# EAGLE schematic sr44-aka-companion (EAGLE 9.6.2)

## Sheet 1 of 3
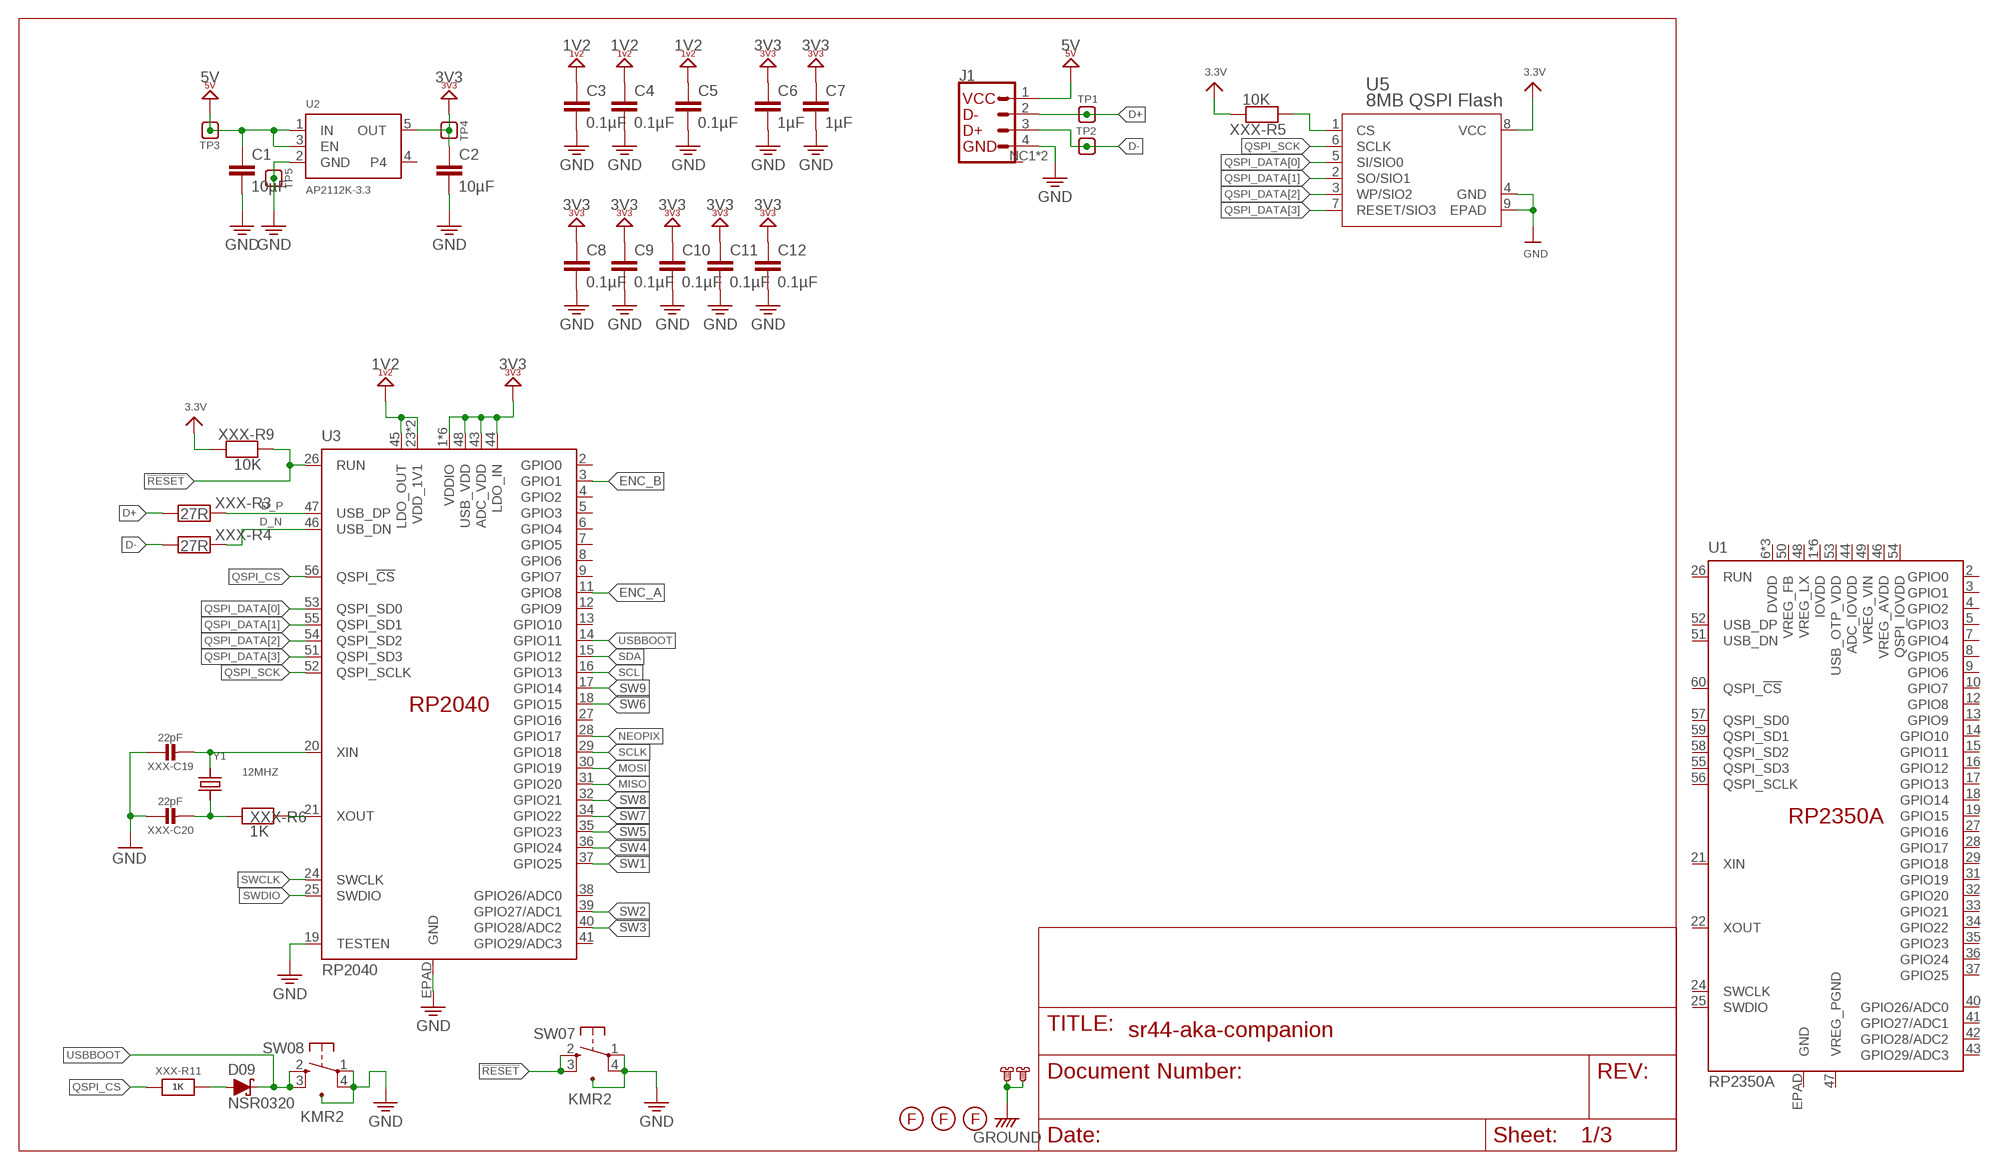
[diagram p0: schematic, sheet 1]

### Parts
C1  10µF  C-EUC0603  [C0603]
C2  10µF  C-EUC0603  [C0603]
C3  0.1µF  C-EUC0603  [C0603]
C4  0.1µF  C-EUC0603  [C0603]
C5  0.1µF  C-EUC0603  [C0603]
C6  1µF  C-EUC0603  [C0603]
C7  1µF  C-EUC0603  [C0603]
C8  0.1µF  C-EUC0603  [C0603]
C9  0.1µF  C-EUC0603  [C0603]
C10  0.1µF  C-EUC0603  [C0603]
C11  0.1µF  C-EUC0603  [C0603]
C12  0.1µF  C-EUC0603  [C0603]
D09  NSR0320  1N5819WS  [SOD-123]
J1  UBD-S1_C4  [MOLEX_781710004]
SW07  KMR2  KMR221GLFSSW4_KMR221GLFS_CNK  [SW4_KMR221GLFS_CNK]
SW08  KMR2  KMR221GLFSSW4_KMR221GLFS_CNK  [SW4_KMR221GLFS_CNK]
TP1  TEST-POINT.3RN  [PAD.03X.03-RN]
TP2  TEST-POINT.3RN  [PAD.03X.03-RN]
TP3  TEST-POINT.3RN  [PAD.03X.03-RN]
TP4  TEST-POINT.3RN  [PAD.03X.03-RN]
TP5  TEST-POINT.3RN  [PAD.03X.03-RN]
U1  RP2350A  [QFN-60]
U2  AP2112K-3.3  VREG_SOT23-5  [SOT23-5]
U3  RP2040  [QFN-56]
U5  8MB QSPI Flash  MX25R1635FZUIL0USON-8L-2X3X0P6_MAC-M  [USON-8L-2X3X0P6_MAC-M]
U$44  MOUNTING-HOLE-2.2  [MOUNTING-HOLE-2.2]
U$51  MOUNTING-HOLE-2.2  [MOUNTING-HOLE-2.2]
U$54  FIDUCIAL  [FIDUCIAL]
U$55  FIDUCIAL  [FIDUCIAL]
U$56  FIDUCIAL  [FIDUCIAL]
XXX-C19  22pF  CAP_CERAMIC_0402NO  [_0402NO]
XXX-C20  22pF  CAP_CERAMIC_0402NO  [_0402NO]
XXX-R3  27R  RESISTOR_0402NO  [_0402NO]
XXX-R4  27R  RESISTOR_0402NO  [_0402NO]
XXX-R5  10K  RESISTOR_0402NO  [_0402NO]
XXX-R6  1K  RESISTOR_0402NO  [_0402NO]
XXX-R9  10K  RESISTOR_0402NO  [_0402NO]
XXX-R11  1K  RESISTOR_0402NO  [_0402NO]
Y1  12MHZ  CRYSTAL2.5X2.0  [CRYSTAL_2.5X2]

### Nets
3.3V [power]: U5.8(VCC) XXX-R5.2 XXX-R9.1
!RESET: SW07.2 SW07.3 U3.26(RUN) XXX-R9.2
D+: J1.2(DN) TP1.1 XXX-R3.2
D-: J1.3(DP) TP2.1 XXX-R4.2
D_N: U3.46(USB_DN) XXX-R4.1
D_P: U3.47(USB_DP) XXX-R3.1
ENC_A: U3.11(GPIO8)
ENC_B: U3.3(GPIO1)
GND: C1.2 C2.2 C3.2 C4.2 C5.2 C6.2 C7.2 C8.2 C9.2 C10.2 C11.2 C12.2 J1.4(GND) SW07.1 SW07.4 SW07.5 SW08.1 SW08.4 SW08.5 TP5.1 U2.2(GND) U3.19(TESTEN) U3.EPAD(GND) U5.4(GND) U5.9(EPAD) XXX-C19.1 XXX-C20.1 ; also sheet 3
GROUND: U$44.P$1@1 U$44.P$1@2 U$44.P$1@3 U$44.P$1@4 U$44.P$1@5 U$44.P$1@6 U$51.P$1@1 U$51.P$1@2 U$51.P$1@3 U$51.P$1@4 U$51.P$1@5 U$51.P$1@6
MISO: U3.31(GPIO20)
MOSI: U3.30(GPIO19)
N$68: D09.A XXX-R11.2
N$107: U3.20(XIN) XXX-C19.2 Y1.3
N$125: XXX-C20.2 XXX-R6.1 Y1.1
N$127: U3.21(XOUT) XXX-R6.2
NEOPIX: U3.28(GPIO17)
QSPI_CS: U3.56(QSPI_!CS!) U5.1(CS) XXX-R5.1 XXX-R11.1
QSPI_DATA[0]: U3.53(QSPI_SD0) U5.5(SI/SIO0)
QSPI_DATA[1]: U3.55(QSPI_SD1) U5.2(SO/SIO1)
QSPI_DATA[2]: U3.54(QSPI_SD2) U5.3(WP/SIO2)
QSPI_DATA[3]: U3.51(QSPI_SD3) U5.7(RESET/SIO3)
QSPI_SCK: U3.52(QSPI_SCLK) U5.6(SCLK)
SCL: U3.16(GPIO13)
SCLK: U3.29(GPIO18)
SDA: U3.15(GPIO12)
SW1: U3.37(GPIO25)
SW2: U3.39(GPIO27/ADC1)
SW3: U3.40(GPIO28/ADC2)
SW4: U3.36(GPIO24)
SW5: U3.35(GPIO23)
SW6: U3.18(GPIO15)
SW7: U3.34(GPIO22)
SW8: U3.32(GPIO21)
SW9: U3.17(GPIO14)
SWCLK: U3.24(SWCLK)
SWDIO: U3.25(SWDIO)
USBBOOT: D09.C SW08.2 SW08.3 U3.14(GPIO11)
VCC2 [power]: C3.1 C4.1 C5.1 U3.23(VDD_1V1) U3.45(LDO_OUT) U3.50(VDD_1V1) ; supply symbol labelled 1V2
VCC3: C2.1 C6.1 C7.1 C8.1 C9.1 C10.1 C11.1 C12.1 TP4.1 U2.5(OUT) U3.1(VDDIO) U3.10(VDDIO) U3.22(VDDIO) U3.33(VDDIO) U3.42(VDDIO) U3.43(ADC_VDD) U3.44(LDO_IN) U3.48(USB_VDD) U3.49(VDDIO) ; supply symbol labelled 3V3 ; also sheet 3
VCC5: C1.1 J1.1(VCC) TP3.1 U2.1(IN) U2.3(EN) ; supply symbol labelled 5V ; also sheet 3
Unconnected: J1.NC1(M) J1.NC2(M) U1.1(IOVDD) U1.2(GPIO0) U1.3(GPIO1) U1.4(GPIO2) U1.5(GPIO3) U1.6(DVDD) U1.7(GPIO4) U1.8(GPIO5) U1.9(GPIO6) U1.10(GPIO7) U1.11(IOVDD) U1.12(GPIO8) U1.13(GPIO9) U1.14(GPIO10) U1.15(GPIO11) U1.16(GPIO12) U1.17(GPIO13) U1.18(GPIO14) U1.19(GPIO15) U1.20(IOVDD) U1.21(XIN) U1.22(XOUT) U1.23(DVDD) U1.24(SWCLK) U1.25(SWDIO) U1.26(RUN) U1.27(GPIO16) U1.28(GPIO17) U1.29(GPIO18) U1.30(IOVDD) U1.31(GPIO19) U1.32(GPIO20) U1.33(GPIO21) U1.34(GPIO22) U1.35(GPIO23) U1.36(GPIO24) U1.37(GPIO25) U1.38(IOVDD) U1.39(DVDD) U1.40(GPIO26/ADC0) U1.41(GPIO27/ADC1) U1.42(GPIO28/ADC2) U1.43(GPIO29/ADC3) U1.44(ADC_IOVDD) U1.45(IOVDD) U1.46(VREG_AVDD) U1.47(VREG_PGND) U1.48(VREG_LX) U1.49(VREG_VIN) U1.50(VREG_FB) U1.51(USB_DN) U1.52(USB_DP) U1.53(USB_OTP_VDD) U1.54(QSPI_IOVDD) U1.55(QSPI_SD3) U1.56(QSPI_SCLK) U1.57(QSPI_SD0) U1.58(QSPI_SD2) U1.59(QSPI_SD1) U1.60(QSPI_!CS!) U1.EPAD(GND) U2.4 U3.2(GPIO0) U3.4(GPIO2) U3.5(GPIO3) U3.6(GPIO4) U3.7(GPIO5) U3.8(GPIO6) U3.9(GPIO7) U3.12(GPIO9) U3.13(GPIO10) U3.27(GPIO16) U3.38(GPIO26/ADC0) U3.41(GPIO29/ADC3)

## Sheet 2 of 3
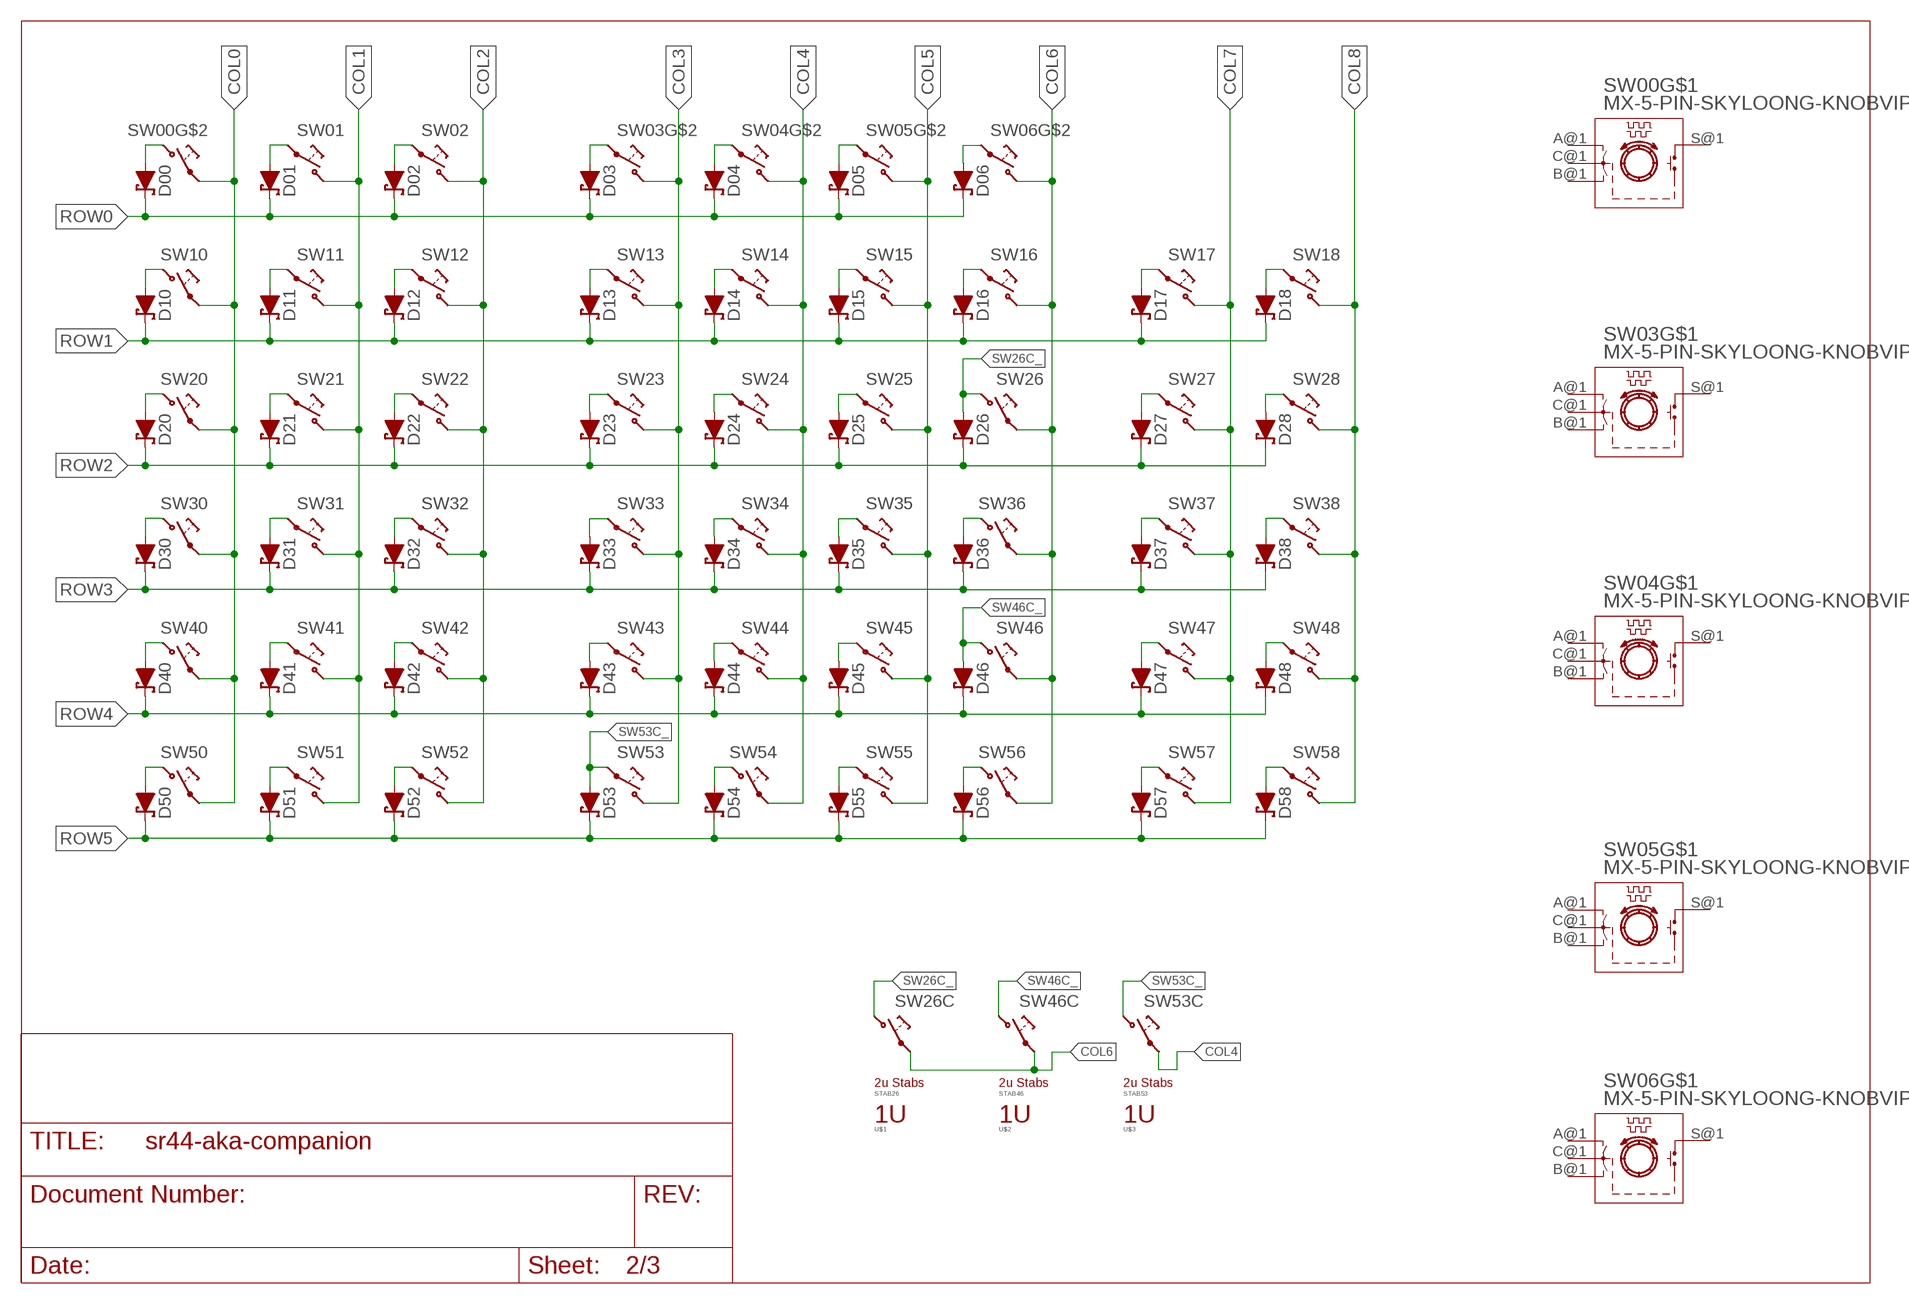
[diagram p1: schematic, sheet 2]

### Parts
D00  1N5819WS  [SOD-123]
D01  1N5819WS  [SOD-123]
D02  1N5819WS  [SOD-123]
D03  1N5819WS  [SOD-123]
D04  1N5819WS  [SOD-123]
D05  1N5819WS  [SOD-123]
D06  1N5819WS  [SOD-123]
D10  1N5819WS  [SOD-123]
D11  1N5819WS  [SOD-123]
D12  1N5819WS  [SOD-123]
D13  1N5819WS  [SOD-123]
D14  1N5819WS  [SOD-123]
D15  1N5819WS  [SOD-123]
D16  1N5819WS  [SOD-123]
D17  1N5819WS  [SOD-123]
D18  1N5819WS  [SOD-123]
D20  1N5819WS  [SOD-123]
D21  1N5819WS  [SOD-123]
D22  1N5819WS  [SOD-123]
D23  1N5819WS  [SOD-123]
D24  1N5819WS  [SOD-123]
D25  1N5819WS  [SOD-123]
D26  1N5819WS  [SOD-123]
D27  1N5819WS  [SOD-123]
D28  1N5819WS  [SOD-123]
D30  1N5819WS  [SOD-123]
D31  1N5819WS  [SOD-123]
D32  1N5819WS  [SOD-123]
D33  1N5819WS  [SOD-123]
D34  1N5819WS  [SOD-123]
D35  1N5819WS  [SOD-123]
D36  1N5819WS  [SOD-123]
D37  1N5819WS  [SOD-123]
D38  1N5819WS  [SOD-123]
D40  1N5819WS  [SOD-123]
D41  1N5819WS  [SOD-123]
D42  1N5819WS  [SOD-123]
D43  1N5819WS  [SOD-123]
D44  1N5819WS  [SOD-123]
D45  1N5819WS  [SOD-123]
D46  1N5819WS  [SOD-123]
D47  1N5819WS  [SOD-123]
D48  1N5819WS  [SOD-123]
D50  1N5819WS  [SOD-123]
D51  1N5819WS  [SOD-123]
D52  1N5819WS  [SOD-123]
D53  1N5819WS  [SOD-123]
D54  1N5819WS  [SOD-123]
D55  1N5819WS  [SOD-123]
D56  1N5819WS  [SOD-123]
D57  1N5819WS  [SOD-123]
D58  1N5819WS  [SOD-123]
STAB26  MX-STABS-200U  [MX-STABS-200U]
STAB46  MX-STABS-200U  [MX-STABS-200U]
STAB53  MX-STABS-200U  [MX-STABS-200U]
SW00  MX-5-PIN-SKYLOONG-KNOBVIP  [MX-5-PIN-SKYLOONG-KNOB-VIP]
SW01  MX-5-PIN-HOTSWAP-VIAVIP  [MX-5-PIN-HOTSWAP-VIA+VIP-NS]
SW02  MX-5-PIN-HOTSWAP-VIAVIP  [MX-5-PIN-HOTSWAP-VIA+VIP-NS]
SW03  MX-5-PIN-SKYLOONG-KNOBVIP  [MX-5-PIN-SKYLOONG-KNOB-VIP]
SW04  MX-5-PIN-SKYLOONG-KNOBVIP  [MX-5-PIN-SKYLOONG-KNOB-VIP]
SW05  MX-5-PIN-SKYLOONG-KNOBVIP  [MX-5-PIN-SKYLOONG-KNOB-VIP]
SW06  MX-5-PIN-SKYLOONG-KNOBVIP  [MX-5-PIN-SKYLOONG-KNOB-VIP]
SW10  MX-5-PIN-HOTSWAP-VIAVIP  [MX-5-PIN-HOTSWAP-VIA+VIP-NS]
SW11  MX-5-PIN-HOTSWAP-VIAVIP  [MX-5-PIN-HOTSWAP-VIA+VIP-NS]
SW12  MX-5-PIN-HOTSWAP-VIAVIP  [MX-5-PIN-HOTSWAP-VIA+VIP-NS]
SW13  MX-5-PIN-HOTSWAP-VIAVIP  [MX-5-PIN-HOTSWAP-VIA+VIP-NS]
SW14  MX-5-PIN-HOTSWAP-VIAVIP  [MX-5-PIN-HOTSWAP-VIA+VIP-NS]
SW15  MX-5-PIN-HOTSWAP-VIAVIP  [MX-5-PIN-HOTSWAP-VIA+VIP-NS]
SW16  MX-5-PIN-HOTSWAP-VIAVIP  [MX-5-PIN-HOTSWAP-VIA+VIP-NS]
SW17  MX-5-PIN-HOTSWAP-VIAVIP  [MX-5-PIN-HOTSWAP-VIA+VIP-NS]
SW18  MX-5-PIN-HOTSWAP-VIAVIP  [MX-5-PIN-HOTSWAP-VIA+VIP-NS]
SW20  MX-5-PIN-HOTSWAP-VIAVIP  [MX-5-PIN-HOTSWAP-VIA+VIP-NS]
SW21  MX-5-PIN-HOTSWAP-VIAVIP  [MX-5-PIN-HOTSWAP-VIA+VIP-NS]
SW22  MX-5-PIN-HOTSWAP-VIAVIP  [MX-5-PIN-HOTSWAP-VIA+VIP-NS]
SW23  MX-5-PIN-HOTSWAP-VIAVIP  [MX-5-PIN-HOTSWAP-VIA+VIP-NS]
SW24  MX-5-PIN-HOTSWAP-VIAVIP  [MX-5-PIN-HOTSWAP-VIA+VIP-NS]
SW25  MX-5-PIN-HOTSWAP-VIAVIP  [MX-5-PIN-HOTSWAP-VIA+VIP-NS]
SW26  MX-5-PIN-HOTSWAP-VIAVIP  [MX-5-PIN-HOTSWAP-VIA+VIP-NS]
SW26C  MX-5-PIN-HOTSWAP-VIAVIP  [MX-5-PIN-HOTSWAP-VIA+VIP-NS]
SW27  MX-5-PIN-HOTSWAP-VIAVIP  [MX-5-PIN-HOTSWAP-VIA+VIP-NS]
SW28  MX-5-PIN-HOTSWAP-VIAVIP  [MX-5-PIN-HOTSWAP-VIA+VIP-NS]
SW30  MX-5-PIN-HOTSWAP-VIAVIP  [MX-5-PIN-HOTSWAP-VIA+VIP-NS]
SW31  MX-5-PIN-HOTSWAP-VIAVIP  [MX-5-PIN-HOTSWAP-VIA+VIP-NS]
SW32  MX-5-PIN-HOTSWAP-VIAVIP  [MX-5-PIN-HOTSWAP-VIA+VIP-NS]
SW33  MX-5-PIN-HOTSWAP-VIAVIP  [MX-5-PIN-HOTSWAP-VIA+VIP-NS]
SW34  MX-5-PIN-HOTSWAP-VIAVIP  [MX-5-PIN-HOTSWAP-VIA+VIP-NS]
SW35  MX-5-PIN-HOTSWAP-VIAVIP  [MX-5-PIN-HOTSWAP-VIA+VIP-NS]
SW36  MX-5-PIN-HOTSWAP-VIAVIP  [MX-5-PIN-HOTSWAP-VIA+VIP-NS]
SW37  MX-5-PIN-HOTSWAP-VIAVIP  [MX-5-PIN-HOTSWAP-VIA+VIP-NS]
SW38  MX-5-PIN-HOTSWAP-VIAVIP  [MX-5-PIN-HOTSWAP-VIA+VIP-NS]
SW40  MX-5-PIN-HOTSWAP-VIAVIP  [MX-5-PIN-HOTSWAP-VIA+VIP-NS]
SW41  MX-5-PIN-HOTSWAP-VIAVIP  [MX-5-PIN-HOTSWAP-VIA+VIP-NS]
SW42  MX-5-PIN-HOTSWAP-VIAVIP  [MX-5-PIN-HOTSWAP-VIA+VIP-NS]
SW43  MX-5-PIN-HOTSWAP-VIAVIP  [MX-5-PIN-HOTSWAP-VIA+VIP-NS]
SW44  MX-5-PIN-HOTSWAP-VIAVIP  [MX-5-PIN-HOTSWAP-VIA+VIP-NS]
SW45  MX-5-PIN-HOTSWAP-VIAVIP  [MX-5-PIN-HOTSWAP-VIA+VIP-NS]
SW46  MX-5-PIN-HOTSWAP-VIAVIP  [MX-5-PIN-HOTSWAP-VIA+VIP-NS]
SW46C  MX-5-PIN-HOTSWAP-VIAVIP  [MX-5-PIN-HOTSWAP-VIA+VIP-NS]
SW47  MX-5-PIN-HOTSWAP-VIAVIP  [MX-5-PIN-HOTSWAP-VIA+VIP-NS]
SW48  MX-5-PIN-HOTSWAP-VIAVIP  [MX-5-PIN-HOTSWAP-VIA+VIP-NS]
SW50  MX-5-PIN-HOTSWAP-VIAVIP  [MX-5-PIN-HOTSWAP-VIA+VIP-NS]
SW51  MX-5-PIN-HOTSWAP-VIAVIP  [MX-5-PIN-HOTSWAP-VIA+VIP-NS]
SW52  MX-5-PIN-HOTSWAP-VIAVIP  [MX-5-PIN-HOTSWAP-VIA+VIP-NS]
SW53  MX-5-PIN-HOTSWAP-VIAVIP  [MX-5-PIN-HOTSWAP-VIA+VIP-NS]
SW53C  MX-5-PIN-HOTSWAP-VIAVIP  [MX-5-PIN-HOTSWAP-VIA+VIP-NS]
SW54  MX-5-PIN-HOTSWAP-VIAVIP  [MX-5-PIN-HOTSWAP-VIA+VIP-NS]
SW55  MX-5-PIN-HOTSWAP-VIAVIP  [MX-5-PIN-HOTSWAP-VIA+VIP-NS]
SW56  MX-5-PIN-HOTSWAP-VIAVIP  [MX-5-PIN-HOTSWAP-VIA+VIP-NS]
SW57  MX-5-PIN-HOTSWAP-VIAVIP  [MX-5-PIN-HOTSWAP-VIA+VIP-NS]
SW58  MX-5-PIN-HOTSWAP-VIAVIP  [MX-5-PIN-HOTSWAP-VIA+VIP-NS]
U$1  MX-FPRINT-100U-PLACE  [MX-FPRINT-PLACE-100U]
U$2  MX-FPRINT-100U-PLACE  [MX-FPRINT-PLACE-100U]
U$3  MX-FPRINT-100U-PLACE  [MX-FPRINT-PLACE-100U]

### Nets
COL0: SW00.1@1 SW00.1@2 SW00.1@3 SW10.1@1 SW10.1@2 SW10.1@3 SW20.1@1 SW20.1@2 SW20.1@3 SW30.1@1 SW30.1@2 SW30.1@3 SW40.1@1 SW40.1@2 SW40.1@3 SW50.1@1 SW50.1@2 SW50.1@3
COL1: SW01.2@1 SW01.2@2 SW01.2@3 SW11.2@1 SW11.2@2 SW11.2@3 SW21.2@1 SW21.2@2 SW21.2@3 SW31.2@1 SW31.2@2 SW31.2@3 SW41.2@1 SW41.2@2 SW41.2@3 SW51.2@1 SW51.2@2 SW51.2@3
COL2: SW02.2@1 SW02.2@2 SW02.2@3 SW12.2@1 SW12.2@2 SW12.2@3 SW22.2@1 SW22.2@2 SW22.2@3 SW32.2@1 SW32.2@2 SW32.2@3 SW42.2@1 SW42.2@2 SW42.2@3 SW52.2@1 SW52.2@2 SW52.2@3
COL3: SW03.2@1 SW03.2@2 SW03.2@3 SW13.2@1 SW13.2@2 SW13.2@3 SW23.2@1 SW23.2@2 SW23.2@3 SW33.2@1 SW33.2@2 SW33.2@3 SW43.2@1 SW43.2@2 SW43.2@3 SW53.2@1 SW53.2@2 SW53.2@3
COL4: SW04.2@1 SW04.2@2 SW04.2@3 SW14.2@1 SW14.2@2 SW14.2@3 SW24.2@1 SW24.2@2 SW24.2@3 SW34.2@1 SW34.2@2 SW34.2@3 SW44.2@1 SW44.2@2 SW44.2@3 SW53C.1@1 SW53C.1@2 SW53C.1@3 SW54.1@1 SW54.1@2 SW54.1@3
COL5: SW05.2@1 SW05.2@2 SW05.2@3 SW15.2@1 SW15.2@2 SW15.2@3 SW25.2@1 SW25.2@2 SW25.2@3 SW35.2@1 SW35.2@2 SW35.2@3 SW45.2@1 SW45.2@2 SW45.2@3 SW55.2@1 SW55.2@2 SW55.2@3
COL6: SW06.2@1 SW06.2@2 SW06.2@3 SW16.2@1 SW16.2@2 SW16.2@3 SW26.1@1 SW26.1@2 SW26.1@3 SW26C.1@1 SW26C.1@2 SW26C.1@3 SW36.1@1 SW36.1@2 SW36.1@3 SW46.1@1 SW46.1@2 SW46.1@3 SW46C.1@1 SW46C.1@2 SW46C.1@3 SW56.1@1 SW56.1@2 SW56.1@3
COL7: SW17.2@1 SW17.2@2 SW17.2@3 SW27.2@1 SW27.2@2 SW27.2@3 SW37.2@1 SW37.2@2 SW37.2@3 SW47.2@1 SW47.2@2 SW47.2@3 SW57.2@1 SW57.2@2 SW57.2@3
COL8: SW18.2@1 SW18.2@2 SW18.2@3 SW28.2@1 SW28.2@2 SW28.2@3 SW38.2@1 SW38.2@2 SW38.2@3 SW48.2@1 SW48.2@2 SW48.2@3 SW58.2@1 SW58.2@2 SW58.2@3
N$1: D00.A SW00.2@1 SW00.2@2 SW00.2@3
N$2: D01.A SW01.1@1 SW01.1@2 SW01.1@3
N$3: D02.A SW02.1@1 SW02.1@2 SW02.1@3
N$4: D55.A SW55.1@1 SW55.1@2 SW55.1@3
N$5: D54.A SW54.2@1 SW54.2@2 SW54.2@3
N$6: D56.A SW56.2@1 SW56.2@2 SW56.2@3
N$7: D28.A SW28.1@1 SW28.1@2 SW28.1@3
N$8: D36.A SW36.2@1 SW36.2@2 SW36.2@3
N$9: D03.A SW03.1@1 SW03.1@2 SW03.1@3
N$10: D04.A SW04.1@1 SW04.1@2 SW04.1@3
N$11: D05.A SW05.1@1 SW05.1@2 SW05.1@3
N$12: D06.A SW06.1@1 SW06.1@2 SW06.1@3
N$13: D16.A SW16.1@1 SW16.1@2 SW16.1@3
N$14: D15.A SW15.1@1 SW15.1@2 SW15.1@3
N$15: D14.A SW14.1@1 SW14.1@2 SW14.1@3
N$16: D13.A SW13.1@1 SW13.1@2 SW13.1@3
N$17: D12.A SW12.1@1 SW12.1@2 SW12.1@3
N$18: D11.A SW11.1@1 SW11.1@2 SW11.1@3
N$19: D10.A SW10.2@1 SW10.2@2 SW10.2@3
N$20: D27.A SW27.1@1 SW27.1@2 SW27.1@3
N$21: D37.A SW37.1@1 SW37.1@2 SW37.1@3
N$22: D47.A SW47.1@1 SW47.1@2 SW47.1@3
N$23: D57.A SW57.1@1 SW57.1@2 SW57.1@3
N$24: D58.A SW58.1@1 SW58.1@2 SW58.1@3
N$25: D48.A SW48.1@1 SW48.1@2 SW48.1@3
N$26: D17.A SW17.1@1 SW17.1@2 SW17.1@3
N$27: D18.A SW18.1@1 SW18.1@2 SW18.1@3
N$28: D38.A SW38.1@1 SW38.1@2 SW38.1@3
N$29: D45.A SW45.1@1 SW45.1@2 SW45.1@3
N$30: D44.A SW44.1@1 SW44.1@2 SW44.1@3
N$31: D43.A SW43.1@1 SW43.1@2 SW43.1@3
N$32: D33.A SW33.1@1 SW33.1@2 SW33.1@3
N$33: D34.A SW34.1@1 SW34.1@2 SW34.1@3
N$34: D35.A SW35.1@1 SW35.1@2 SW35.1@3
N$35: D25.A SW25.1@1 SW25.1@2 SW25.1@3
N$36: D24.A SW24.1@1 SW24.1@2 SW24.1@3
N$37: D23.A SW23.1@1 SW23.1@2 SW23.1@3
N$38: D20.A SW20.2@1 SW20.2@2 SW20.2@3
N$39: D30.A SW30.2@1 SW30.2@2 SW30.2@3
N$40: D40.A SW40.2@1 SW40.2@2 SW40.2@3
N$41: D50.A SW50.2@1 SW50.2@2 SW50.2@3
N$42: D21.A SW21.1@1 SW21.1@2 SW21.1@3
N$43: D22.A SW22.1@1 SW22.1@2 SW22.1@3
N$44: D31.A SW31.1@1 SW31.1@2 SW31.1@3
N$45: D32.A SW32.1@1 SW32.1@2 SW32.1@3
N$46: D42.A SW42.1@1 SW42.1@2 SW42.1@3
N$47: D41.A SW41.1@1 SW41.1@2 SW41.1@3
N$48: D51.A SW51.1@1 SW51.1@2 SW51.1@3
N$49: D52.A SW52.1@1 SW52.1@2 SW52.1@3
ROW0: D00.C D01.C D02.C D03.C D04.C D05.C D06.C
ROW1: D10.C D11.C D12.C D13.C D14.C D15.C D16.C D17.C D18.C
ROW2: D20.C D21.C D22.C D23.C D24.C D25.C D26.C D27.C D28.C
ROW3: D30.C D31.C D32.C D33.C D34.C D35.C D36.C D37.C D38.C
ROW4: D40.C D41.C D42.C D43.C D44.C D45.C D46.C D47.C D48.C
ROW5: D50.C D51.C D52.C D53.C D54.C D55.C D56.C D57.C D58.C
SW26C_: D26.A SW26.2@1 SW26.2@2 SW26.2@3 SW26C.2@1 SW26C.2@2 SW26C.2@3
SW46C_: D46.A SW46.2@1 SW46.2@2 SW46.2@3 SW46C.2@1 SW46C.2@2 SW46C.2@3
SW53C_: D53.A SW53.1@1 SW53.1@2 SW53.1@3 SW53C.2@1 SW53C.2@2 SW53C.2@3
Unconnected: SW00.A@1(A) SW00.B@1(B) SW00.C@1(C) SW00.S@1(S) SW03.A@1(A) SW03.B@1(B) SW03.C@1(C) SW03.S@1(S) SW04.A@1(A) SW04.B@1(B) SW04.C@1(C) SW04.S@1(S) SW05.A@1(A) SW05.B@1(B) SW05.C@1(C) SW05.S@1(S) SW06.A@1(A) SW06.B@1(B) SW06.C@1(C) SW06.S@1(S)

## Sheet 3 of 3
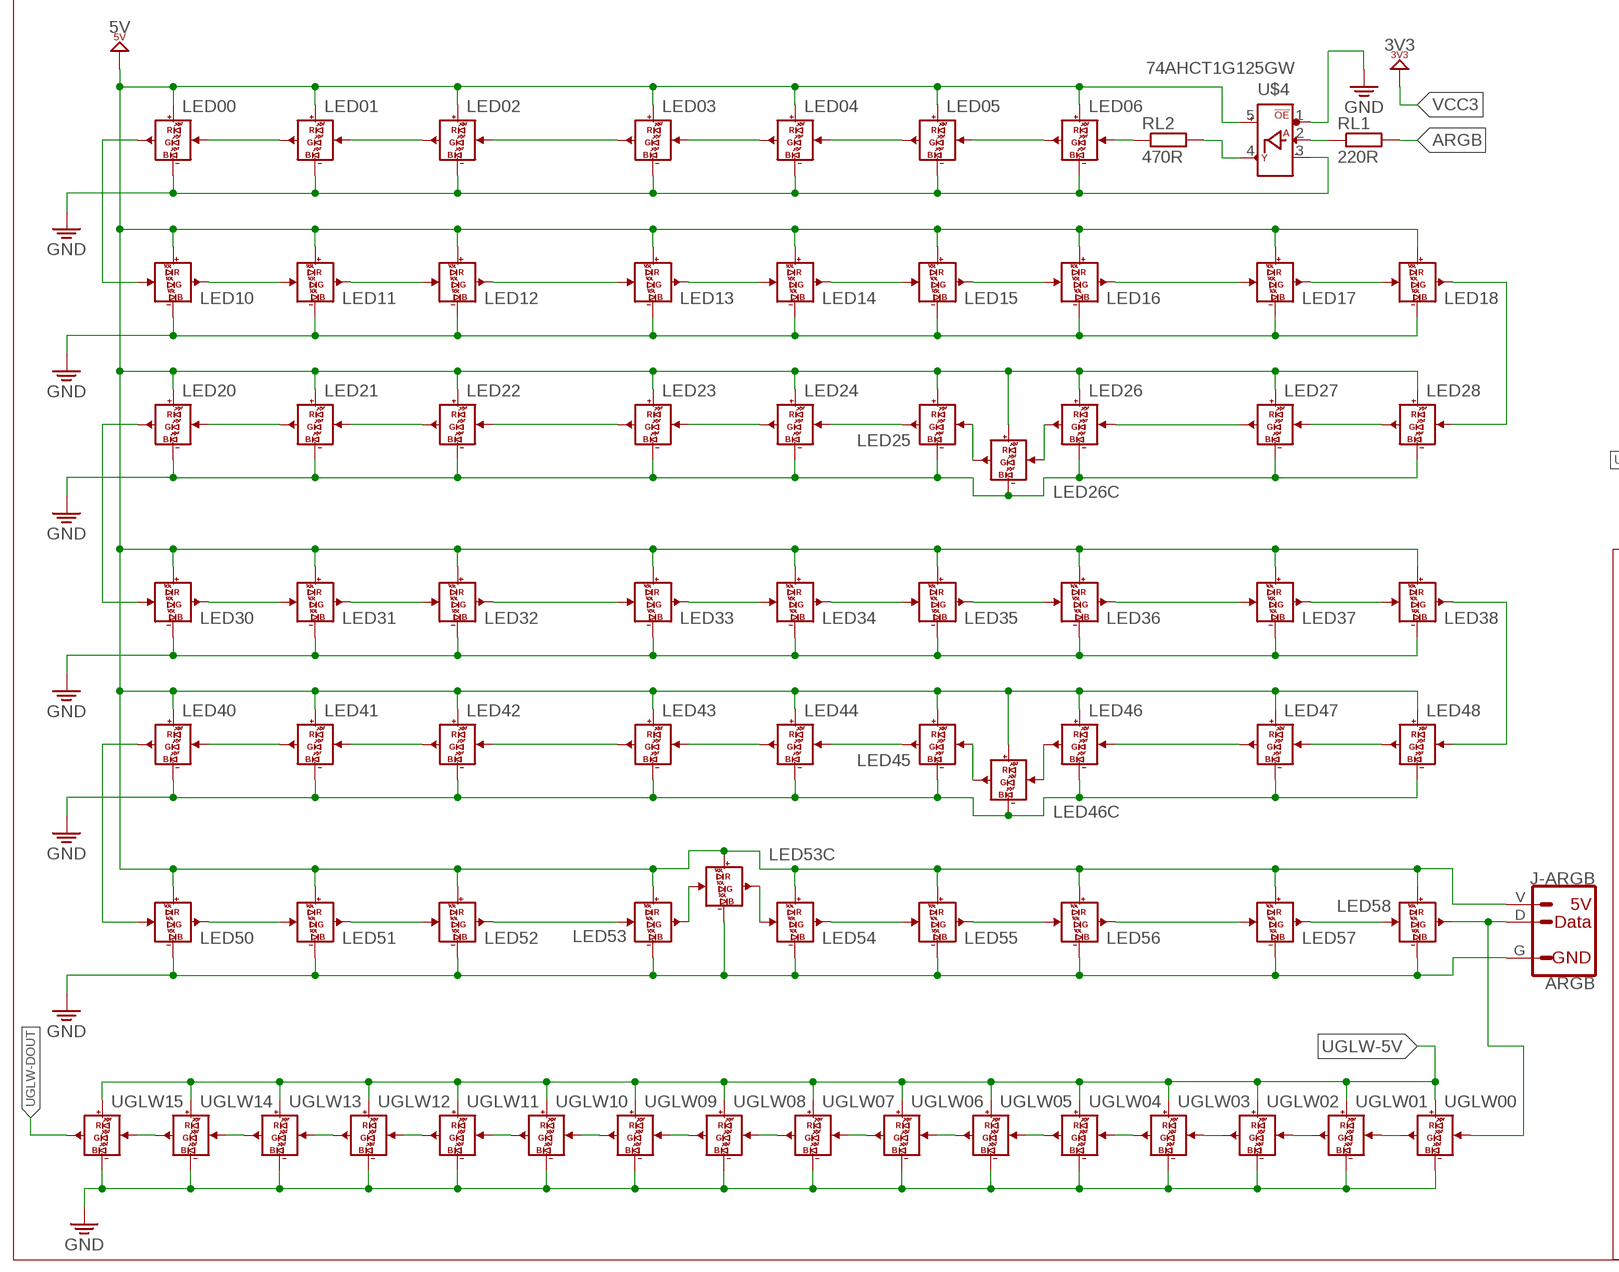
[diagram p2: schematic, sheet 3, part 1 of 2]
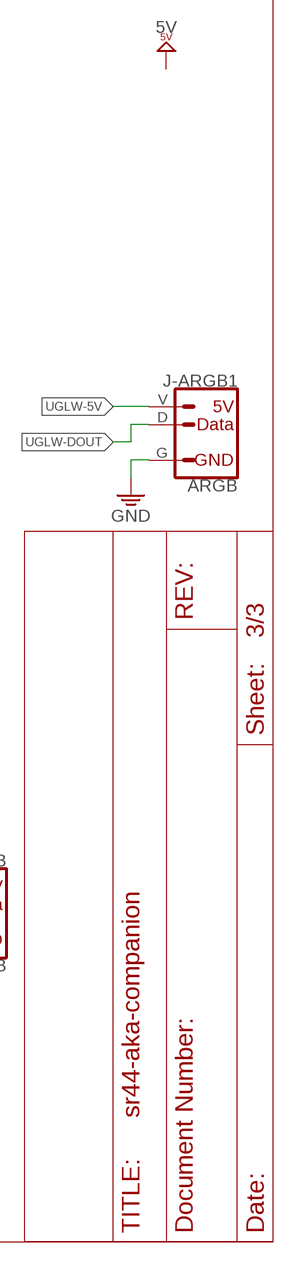
[diagram p3: schematic, sheet 3, part 2 of 2]

### Parts
J-ARGB  ARGB  [ARGB]
J-ARGB1  ARGB  [ARGB]
LED00  SK6812-MINI-ESK6812MINI-E  [SK6812-E-MILL_V2]
LED01  SK6812-MINI-ESK6812MINI-E  [SK6812-E-MILL_V2]
LED02  SK6812-MINI-ESK6812MINI-E  [SK6812-E-MILL_V2]
LED03  SK6812-MINI-ESK6812MINI-E  [SK6812-E-MILL_V2]
LED04  SK6812-MINI-ESK6812MINI-E  [SK6812-E-MILL_V2]
LED05  SK6812-MINI-ESK6812MINI-E  [SK6812-E-MILL_V2]
LED06  SK6812-MINI-ESK6812MINI-E  [SK6812-E-MILL_V2]
LED10  SK6812-MINI-ESK6812MINI-E  [SK6812-E-MILL_V2]
LED11  SK6812-MINI-ESK6812MINI-E  [SK6812-E-MILL_V2]
LED12  SK6812-MINI-ESK6812MINI-E  [SK6812-E-MILL_V2]
LED13  SK6812-MINI-ESK6812MINI-E  [SK6812-E-MILL_V2]
LED14  SK6812-MINI-ESK6812MINI-E  [SK6812-E-MILL_V2]
LED15  SK6812-MINI-ESK6812MINI-E  [SK6812-E-MILL_V2]
LED16  SK6812-MINI-ESK6812MINI-E  [SK6812-E-MILL_V2]
LED17  SK6812-MINI-ESK6812MINI-E  [SK6812-E-MILL_V2]
LED18  SK6812-MINI-ESK6812MINI-E  [SK6812-E-MILL_V2]
LED20  SK6812-MINI-ESK6812MINI-E  [SK6812-E-MILL_V2]
LED21  SK6812-MINI-ESK6812MINI-E  [SK6812-E-MILL_V2]
LED22  SK6812-MINI-ESK6812MINI-E  [SK6812-E-MILL_V2]
LED23  SK6812-MINI-ESK6812MINI-E  [SK6812-E-MILL_V2]
LED24  SK6812-MINI-ESK6812MINI-E  [SK6812-E-MILL_V2]
LED25  SK6812-MINI-ESK6812MINI-E  [SK6812-E-MILL_V2]
LED26  SK6812-MINI-ESK6812MINI-E  [SK6812-E-MILL_V2]
LED26C  SK6812-MINI-ESK6812MINI-E  [SK6812-E-MILL_V2]
LED27  SK6812-MINI-ESK6812MINI-E  [SK6812-E-MILL_V2]
LED28  SK6812-MINI-ESK6812MINI-E  [SK6812-E-MILL_V2]
LED30  SK6812-MINI-ESK6812MINI-E  [SK6812-E-MILL_V2]
LED31  SK6812-MINI-ESK6812MINI-E  [SK6812-E-MILL_V2]
LED32  SK6812-MINI-ESK6812MINI-E  [SK6812-E-MILL_V2]
LED33  SK6812-MINI-ESK6812MINI-E  [SK6812-E-MILL_V2]
LED34  SK6812-MINI-ESK6812MINI-E  [SK6812-E-MILL_V2]
LED35  SK6812-MINI-ESK6812MINI-E  [SK6812-E-MILL_V2]
LED36  SK6812-MINI-ESK6812MINI-E  [SK6812-E-MILL_V2]
LED37  SK6812-MINI-ESK6812MINI-E  [SK6812-E-MILL_V2]
LED38  SK6812-MINI-ESK6812MINI-E  [SK6812-E-MILL_V2]
LED40  SK6812-MINI-ESK6812MINI-E  [SK6812-E-MILL_V2]
LED41  SK6812-MINI-ESK6812MINI-E  [SK6812-E-MILL_V2]
LED42  SK6812-MINI-ESK6812MINI-E  [SK6812-E-MILL_V2]
LED43  SK6812-MINI-ESK6812MINI-E  [SK6812-E-MILL_V2]
LED44  SK6812-MINI-ESK6812MINI-E  [SK6812-E-MILL_V2]
LED45  SK6812-MINI-ESK6812MINI-E  [SK6812-E-MILL_V2]
LED46  SK6812-MINI-ESK6812MINI-E  [SK6812-E-MILL_V2]
LED46C  SK6812-MINI-ESK6812MINI-E  [SK6812-E-MILL_V2]
LED47  SK6812-MINI-ESK6812MINI-E  [SK6812-E-MILL_V2]
LED48  SK6812-MINI-ESK6812MINI-E  [SK6812-E-MILL_V2]
LED50  SK6812-MINI-ESK6812MINI-E  [SK6812-E-MILL_V2]
LED51  SK6812-MINI-ESK6812MINI-E  [SK6812-E-MILL_V2]
LED52  SK6812-MINI-ESK6812MINI-E  [SK6812-E-MILL_V2]
LED53  SK6812-MINI-ESK6812MINI-E  [SK6812-E-MILL_V2]
LED53C  SK6812-MINI-ESK6812MINI-E  [SK6812-E-MILL_V2]
LED54  SK6812-MINI-ESK6812MINI-E  [SK6812-E-MILL_V2]
LED55  SK6812-MINI-ESK6812MINI-E  [SK6812-E-MILL_V2]
LED56  SK6812-MINI-ESK6812MINI-E  [SK6812-E-MILL_V2]
LED57  SK6812-MINI-ESK6812MINI-E  [SK6812-E-MILL_V2]
LED58  SK6812-MINI-ESK6812MINI-E  [SK6812-E-MILL_V2]
RL1  220R  R-EU_R0603  [R0603]
RL2  470R  R-EU_R0603  [R0603]
U$4  74AHCT1G125GW  [SOT353]
UGLW00  SK6812-MINISK6812MINI  [SK6812_V2]
UGLW01  SK6812-MINISK6812MINI  [SK6812_V2]
UGLW02  SK6812-MINISK6812MINI  [SK6812_V2]
UGLW03  SK6812-MINISK6812MINI  [SK6812_V2]
UGLW04  SK6812-MINISK6812MINI  [SK6812_V2]
UGLW05  SK6812-MINISK6812MINI  [SK6812_V2]
UGLW06  SK6812-MINISK6812MINI  [SK6812_V2]
UGLW07  SK6812-MINISK6812MINI  [SK6812_V2]
UGLW08  SK6812-MINISK6812MINI  [SK6812_V2]
UGLW09  SK6812-MINISK6812MINI  [SK6812_V2]
UGLW10  SK6812-MINISK6812MINI  [SK6812_V2]
UGLW11  SK6812-MINISK6812MINI  [SK6812_V2]
UGLW12  SK6812-MINISK6812MINI  [SK6812_V2]
UGLW13  SK6812-MINISK6812MINI  [SK6812_V2]
UGLW14  SK6812-MINISK6812MINI  [SK6812_V2]
UGLW15  SK6812-MINISK6812MINI  [SK6812_V2]

### Nets
ARGB: RL1.2
GND: J-ARGB1.G J-ARGB.G LED00.3-GND(GND) LED01.3-GND(GND) LED02.3-GND(GND) LED03.3-GND(GND) LED04.3-GND(GND) LED05.3-GND(GND) LED06.3-GND(GND) LED10.3-GND(GND) LED11.3-GND(GND) LED12.3-GND(GND) LED13.3-GND(GND) LED14.3-GND(GND) LED15.3-GND(GND) LED16.3-GND(GND) LED17.3-GND(GND) LED18.3-GND(GND) LED20.3-GND(GND) LED21.3-GND(GND) LED22.3-GND(GND) LED23.3-GND(GND) LED24.3-GND(GND) LED25.3-GND(GND) LED26.3-GND(GND) LED26C.3-GND(GND) LED27.3-GND(GND) LED28.3-GND(GND) LED30.3-GND(GND) LED31.3-GND(GND) LED32.3-GND(GND) LED33.3-GND(GND) LED34.3-GND(GND) LED35.3-GND(GND) LED36.3-GND(GND) LED37.3-GND(GND) LED38.3-GND(GND) LED40.3-GND(GND) LED41.3-GND(GND) LED42.3-GND(GND) LED43.3-GND(GND) LED44.3-GND(GND) LED45.3-GND(GND) LED46.3-GND(GND) LED46C.3-GND(GND) LED47.3-GND(GND) LED48.3-GND(GND) LED50.3-GND(GND) LED51.3-GND(GND) LED52.3-GND(GND) LED53.3-GND(GND) LED53C.3-GND(GND) LED54.3-GND(GND) LED55.3-GND(GND) LED56.3-GND(GND) LED57.3-GND(GND) LED58.3-GND(GND) U$4.1(!OE) U$4.3(3_GND) UGLW00.4-GND(GND) UGLW01.4-GND(GND) UGLW02.4-GND(GND) UGLW03.4-GND(GND) UGLW04.4-GND(GND) UGLW05.4-GND(GND) UGLW06.4-GND(GND) UGLW07.4-GND(GND) UGLW08.4-GND(GND) UGLW09.4-GND(GND) UGLW10.4-GND(GND) UGLW11.4-GND(GND) UGLW12.4-GND(GND) UGLW13.4-GND(GND) UGLW14.4-GND(GND) UGLW15.4-GND(GND) ; also sheet 1
N$50: LED05.4-DIN(DIN) LED06.2-DOUT(DOUT)
N$51: LED04.4-DIN(DIN) LED05.2-DOUT(DOUT)
N$52: LED03.4-DIN(DIN) LED04.2-DOUT(DOUT)
N$53: LED02.4-DIN(DIN) LED03.2-DOUT(DOUT)
N$54: LED01.4-DIN(DIN) LED02.2-DOUT(DOUT)
N$55: LED00.4-DIN(DIN) LED01.2-DOUT(DOUT)
N$56: LED00.2-DOUT(DOUT) LED10.4-DIN(DIN)
N$57: LED10.2-DOUT(DOUT) LED11.4-DIN(DIN)
N$58: LED11.2-DOUT(DOUT) LED12.4-DIN(DIN)
N$59: LED12.2-DOUT(DOUT) LED13.4-DIN(DIN)
N$60: LED13.2-DOUT(DOUT) LED14.4-DIN(DIN)
N$61: LED14.2-DOUT(DOUT) LED15.4-DIN(DIN)
N$62: LED15.2-DOUT(DOUT) LED16.4-DIN(DIN)
N$63: LED16.2-DOUT(DOUT) LED17.4-DIN(DIN)
N$64: LED17.2-DOUT(DOUT) LED18.4-DIN(DIN)
N$65: LED18.2-DOUT(DOUT) LED28.4-DIN(DIN)
N$66: LED27.4-DIN(DIN) LED28.2-DOUT(DOUT)
N$67: LED26.4-DIN(DIN) LED27.2-DOUT(DOUT)
N$69: LED53.2-DOUT(DOUT) LED53C.4-DIN(DIN)
N$70: LED24.4-DIN(DIN) LED25.2-DOUT(DOUT)
N$71: LED23.4-DIN(DIN) LED24.2-DOUT(DOUT)
N$72: LED22.4-DIN(DIN) LED23.2-DOUT(DOUT)
N$73: LED21.4-DIN(DIN) LED22.2-DOUT(DOUT)
N$74: LED20.4-DIN(DIN) LED21.2-DOUT(DOUT)
N$75: LED20.2-DOUT(DOUT) LED30.4-DIN(DIN)
N$76: LED30.2-DOUT(DOUT) LED31.4-DIN(DIN)
N$77: LED31.2-DOUT(DOUT) LED32.4-DIN(DIN)
N$78: LED32.2-DOUT(DOUT) LED33.4-DIN(DIN)
N$79: LED33.2-DOUT(DOUT) LED34.4-DIN(DIN)
N$80: LED34.2-DOUT(DOUT) LED35.4-DIN(DIN)
N$81: LED35.2-DOUT(DOUT) LED36.4-DIN(DIN)
N$82: LED36.2-DOUT(DOUT) LED37.4-DIN(DIN)
N$83: LED37.2-DOUT(DOUT) LED38.4-DIN(DIN)
N$84: LED38.2-DOUT(DOUT) LED48.4-DIN(DIN)
N$85: LED47.4-DIN(DIN) LED48.2-DOUT(DOUT)
N$86: LED26.2-DOUT(DOUT) LED26C.4-DIN(DIN)
N$87: LED25.4-DIN(DIN) LED26C.2-DOUT(DOUT)
N$88: LED46.4-DIN(DIN) LED47.2-DOUT(DOUT)
N$89: LED44.4-DIN(DIN) LED45.2-DOUT(DOUT)
N$90: LED43.4-DIN(DIN) LED44.2-DOUT(DOUT)
N$91: LED42.4-DIN(DIN) LED43.2-DOUT(DOUT)
N$92: LED41.4-DIN(DIN) LED42.2-DOUT(DOUT)
N$93: LED40.4-DIN(DIN) LED41.2-DOUT(DOUT)
N$94: LED40.2-DOUT(DOUT) LED50.4-DIN(DIN)
N$95: LED50.2-DOUT(DOUT) LED51.4-DIN(DIN)
N$96: LED51.2-DOUT(DOUT) LED52.4-DIN(DIN)
N$97: LED52.2-DOUT(DOUT) LED53.4-DIN(DIN)
N$98: LED53C.2-DOUT(DOUT) LED54.4-DIN(DIN)
N$99: LED45.4-DIN(DIN) LED46C.2-DOUT(DOUT)
N$100: LED54.2-DOUT(DOUT) LED55.4-DIN(DIN)
N$101: LED55.2-DOUT(DOUT) LED56.4-DIN(DIN)
N$102: LED56.2-DOUT(DOUT) LED57.4-DIN(DIN)
N$103: LED57.2-DOUT(DOUT) LED58.4-DIN(DIN)
N$104: UGLW02.3-DOUT(DOUT) UGLW03.1-DIN(DIN)
N$105: UGLW01.3-DOUT(DOUT) UGLW02.1-DIN(DIN)
N$106: UGLW00.3-DOUT(DOUT) UGLW01.1-DIN(DIN)
N$108: UGLW03.3-DOUT(DOUT) UGLW04.1-DIN(DIN)
N$109: UGLW04.3-DOUT(DOUT) UGLW05.1-DIN(DIN)
N$110: UGLW05.3-DOUT(DOUT) UGLW06.1-DIN(DIN)
N$111: UGLW06.3-DOUT(DOUT) UGLW07.1-DIN(DIN)
N$112: UGLW07.3-DOUT(DOUT) UGLW08.1-DIN(DIN)
N$113: UGLW08.3-DOUT(DOUT) UGLW09.1-DIN(DIN)
N$114: UGLW09.3-DOUT(DOUT) UGLW10.1-DIN(DIN)
N$115: UGLW10.3-DOUT(DOUT) UGLW11.1-DIN(DIN)
N$116: LED46.2-DOUT(DOUT) LED46C.4-DIN(DIN)
N$117: J-ARGB.D LED58.2-DOUT(DOUT) UGLW00.1-DIN(DIN)
N$118: UGLW11.3-DOUT(DOUT) UGLW12.1-DIN(DIN)
N$119: LED06.4-DIN(DIN) RL2.1
N$120: RL2.2 U$4.4(Y_DOUT)
N$121: RL1.1 U$4.2(A_DIN)
N$122: UGLW12.3-DOUT(DOUT) UGLW13.1-DIN(DIN)
N$123: UGLW13.3-DOUT(DOUT) UGLW14.1-DIN(DIN)
N$124: UGLW14.3-DOUT(DOUT) UGLW15.1-DIN(DIN)
UGLW-5V: J-ARGB1.V UGLW00.2-VDD(VDD) UGLW01.2-VDD(VDD) UGLW02.2-VDD(VDD) UGLW03.2-VDD(VDD) UGLW04.2-VDD(VDD) UGLW05.2-VDD(VDD) UGLW06.2-VDD(VDD) UGLW07.2-VDD(VDD) UGLW08.2-VDD(VDD) UGLW09.2-VDD(VDD) UGLW10.2-VDD(VDD) UGLW11.2-VDD(VDD) UGLW12.2-VDD(VDD) UGLW13.2-VDD(VDD) UGLW14.2-VDD(VDD) UGLW15.2-VDD(VDD)
UGLW-DOUT: J-ARGB1.D UGLW15.3-DOUT(DOUT)
VCC5: J-ARGB.V LED00.1-VDD(VDD) LED01.1-VDD(VDD) LED02.1-VDD(VDD) LED03.1-VDD(VDD) LED04.1-VDD(VDD) LED05.1-VDD(VDD) LED06.1-VDD(VDD) LED10.1-VDD(VDD) LED11.1-VDD(VDD) LED12.1-VDD(VDD) LED13.1-VDD(VDD) LED14.1-VDD(VDD) LED15.1-VDD(VDD) LED16.1-VDD(VDD) LED17.1-VDD(VDD) LED18.1-VDD(VDD) LED20.1-VDD(VDD) LED21.1-VDD(VDD) LED22.1-VDD(VDD) LED23.1-VDD(VDD) LED24.1-VDD(VDD) LED25.1-VDD(VDD) LED26.1-VDD(VDD) LED26C.1-VDD(VDD) LED27.1-VDD(VDD) LED28.1-VDD(VDD) LED30.1-VDD(VDD) LED31.1-VDD(VDD) LED32.1-VDD(VDD) LED33.1-VDD(VDD) LED34.1-VDD(VDD) LED35.1-VDD(VDD) LED36.1-VDD(VDD) LED37.1-VDD(VDD) LED38.1-VDD(VDD) LED40.1-VDD(VDD) LED41.1-VDD(VDD) LED42.1-VDD(VDD) LED43.1-VDD(VDD) LED44.1-VDD(VDD) LED45.1-VDD(VDD) LED46.1-VDD(VDD) LED46C.1-VDD(VDD) LED47.1-VDD(VDD) LED48.1-VDD(VDD) LED50.1-VDD(VDD) LED51.1-VDD(VDD) LED52.1-VDD(VDD) LED53.1-VDD(VDD) LED53C.1-VDD(VDD) LED54.1-VDD(VDD) LED55.1-VDD(VDD) LED56.1-VDD(VDD) LED57.1-VDD(VDD) LED58.1-VDD(VDD) U$4.5(5_VCC) ; supply symbol labelled 5V ; also sheet 1

## Library data of the parts
C1-C12 = rcl:C-EU: CAPACITOR, European symbol; SPICEPREFIX: C
D00 D01-D06 D09 D10-D18 D20-D28 D30-D38 D40-D48 D50-D58 = jlcpcb_basic_parts:1N5819WS: JLCPCB Part # C8598 Description 40V 600mV@1A 1A SOD-123 Schottky Barrier Diodes (SBD) ROHS Schottky Diode
J1 = tecsmith_keyboards:UBD-S1_C4: SMD 1.2mm pitch Molex Pico-EZmate 4P connector
J-ARGB J-ARGB1 = tecsmith_custom_nick_nacks:ARGB
LED00 LED01-LED06 LED10-LED18 LED20-LED26 LED26C LED27 LED28 LED30-LED38 LED40-LED46 LED46C LED47 LED48 LED50-LED53 LED53C LED54-LED58 = tecsmith_keyboards:SK6812-MINI-E
RL1 RL2 = rcl:R-EU_: RESISTOR, European symbol; SPICEPREFIX: R
STAB26 STAB46 STAB53 = ts_keyboards:MX-STABS-200U
SW00 SW03-SW06 = tecsmith_keyboards:MX-5-PIN-SKYLOONG-KNOB
SW01 SW02 SW10-SW18 SW20-SW26 SW26C SW27 SW28 SW30-SW38 SW40-SW46 SW46C SW47 SW48 SW50-SW53 SW53C SW54-SW58 = ts_keyboards:MX-5-PIN-HOTSWAP-VIA
SW07 SW08 = 2024-11-04_19-55-01_Library:KMR221GLFS
TP1-TP5 = sr01-footprints:TEST-POINT
U1 = rpi:RP2350A: Raspberry Pi RP2350A MCU; PROD_ID: IC-21276
U2 = microbuilder:VREG_SOT23-5: SOT23-5 Fixed Voltage Regulators Part Current Out V Out V In V Dropout θJA (°C/W) TJ (°C) Digikey Part No. ADP121 150mA 3.3V 3.4-5.5V 0.09V @ 150mA -- -- ADP121-AUJZ33R7CT-ND ADP121 150mA 3.0V 3.1-5.5V 0.09V @ 150mA -- -- ADP121-AUJZ30R7CT-ND ADP122 300mA 3.3V 3.4-5.5V 0.085V @ 300mA -- -- ADP122AUJZ-3.3-R7CT-ND ADP1712 300mA 3.3V 3.5-5.5V 0.17V @ 300mA -- -- ADP1712AUJZ-3.3-R7TR-ND AP7311 (Low Cost) 150mA 3.3V 3.5-6V 0.15V @ 150mA -- -- AP7311-33WG-7DICT-ND LD39015M18R 150mA 1.8V 1.9V-5.5V 0.08V @ 100mA -- -- 497-6977-1-ND LP2985A-33DBVR 150mA 3.3V 3.3-16V 0.28V @ 150mA 206 150 296-18479-1-ND MCP1824T-3302E/OT 300mA 3.3V 3.5V-6V 0.2V @ 300mA -- -- MCP1824T-3302E/OTCT-ND MIC5205-2.5YM5 TR 150mA 2.5V 2.7-16V 0.165V @ 150mA -- -- 576-1257-2-ND MIC5205-3.0YM5 TR 150mA 3.0V 3.2V-16V 0.165V @ 150mA -- -- 576-1258-2-ND MIC5205-3.3YM5 TR 150mA 3.3V 3.5V-16V 0.165V @ 150mA -- -- 576-1259-2-ND TPS780330220 150mA 3.3V+2.2V 3.6-5.5V 250mV Max -- -- 296-23332-1-ND TDA3663/N1,135 100mA 3.3V 3.5-45V 0.18V @ 50mA -- -- 568-5343-1-ND Max operating temp can be calculated using θJA, TJ (max junction temperature), and power in watts. Set the "Maximum Ambient Temperature" until it reaches TJ ("Max Junction Temperature"), which is the absolute limit for safe use of the regulator: Heat Sink Temperature Calculator <http://www.daycounter.com/Calculators/Heat-Sink-Temperature-Calculator.phtml> For example, With 12V source into a 3.3V LP2985 and a 30mA load, we are dissipating (12V-3.3V) * 0.03A = 0.261W. With a θJA of 206 °C/W, a TJ of 150°C, and 261mW we can safely use the chip without a heat sink up to 75°C (=147.1°C Junction Temperature).
U3 = tecsmith_rpi:RP2040: Raspberry Pi RP2040 MCU
U5 = 2024-11-04_05-06-15_Library:MX25R1635FZUIL0; COPYRIGHT: Copyright (C) 2024 Ultra Librarian. All rights reserved.; MANUFACTURER_PART_NUMBER: MX25R1635FZUIL0; MFR_NAME: Macronix
U$1-U$3 = ts_keyboards:MX-FPRINT-100U
U$4 = tecsmith_keyboards:74AHCT1G125GW
U$44 U$51 = tecsmith_keyboards:MOUNTING-HOLE
U$54-U$56 = tecsmith_custom_nick_nacks:FIDUCIAL
UGLW00 UGLW01-UGLW09 UGLW10-UGLW15 = tecsmith_keyboards:SK6812-MINI
XXX-C19 XXX-C20 = microbuilder:CAP_CERAMIC: Ceramic Capacitors For new designs, use the packages preceded by an '_' character since they are more reliable: The following footprints should be used on most boards: _0402 - Standard footprint for regular board layouts _0603 - Standard footprint for regular board layouts _0805 - Standard footprint for regular board layouts _1206 - Standard footprint for regular board layouts For extremely tight-pitch boards where space is at a premium, the following 'micro-pitch' footprints can be used (smaller pads, no silkscreen outline, etc.): _0402MP - Micro-pitch footprint for very dense/compact boards _0603MP - Micro-pitch footprint for very dense/compact boards _0805MP - Micro-pitch footprint for very dense/compact boards _1206MP - Micro-pitch footprint for very dense/compact boards
XXX-R3-XXX-R6 XXX-R9 XXX-R11 = microbuilder:RESISTOR: Resistors For new designs, use the packages preceded by an '_' character since they are more reliable: The following footprints should be used on most boards: _0402 - Standard footprint for regular board layouts _0603 - Standard footprint for regular board layouts _0805 - Standard footprint for regular board layouts _1206 - Standard footprint for regular board layouts For extremely tight-pitch boards where space is at a premium, the following 'micro-pitch' footprints can be used (smaller pads, no silkscreen outline, etc.): _0402MP - Micro-pitch footprint for very dense/compact boards _0603MP - Micro-pitch footprint for very dense/compact boards _0805MP - Micro-pitch footprint for very dense/compact boards _1206MP - Micro-pitch footprint for very dense/compact boards
Y1 = microbuilder:CRYSTAL: Crystals HC49UP - Surface Mount Crystal 4.0MHz 18pF +/-30ppm Surface Mount Crystal [Digikey: 535-9857-1-ND] 12.0 MHz Surface Mount Crystal [Digikey: 535-9869-6-ND] 25.0 MHz Surface Mount Crystal [Digikey: 535-9078-1-ND] 2.5 x 2.0mm - MEMs SMT Crystal 16.0 MHz 10pF 20ppm 2.5 x 2.0mm Crystal [Digikey -40-85°C: 535-10923-1-ND] 3.2 x 2.5mm - MEMs SMT Crystal 12.0 MHz 8pF 15ppm 3.2 x 2.5mm Crystal [Digikey: -10-70°C: 644-1047-1-ND -40-125°C: 644-1128-1-ND] 40~85°C cheaper: 644-1173-6-ND 16.0 MHz 8pF 15ppm 3.2 x 2.5mm Crystal [Digikey: -10-70°C: 644-1049-1-ND -40-125°C: 644-1129-2-ND]-40~85°C cheaper: 644-1175-6-ND 16.0 MHz 10pF 10ppm 3.2 x 2.5mm Crystal [Digikey: 644-1100-1-ND] 27.12 MHz 18pF 30ppm 3.2 x 2.5mm Crystal [Digikey: 887-1424-1-ND] 27.12MHz 10pF 10ppm 3.2 x 2.5mm Crystal [Digikey: 887-1329-1-ND] 4.9 x 1.8mm - MEMs SMT Crystal 32.768 KHz 12.5pF 20ppm 4.9 x 1.8mm Crystal [Digikey: SE2415CT-ND] 8.0 x 3.8mm - Surface Mount Crystal 32.768kHz 12.5pF 20ppm -40°C-85°C [Digikey: 535-9166-2-ND] Cylinder 32.768KHz Cylinder Crystal (2x6mm body) [Ex. Digikey: 300-8341-2-ND]

## Net classes
1 power: width 0.203 mm